# EAGLE design BUZZI-06 (EAGLE 4.15)
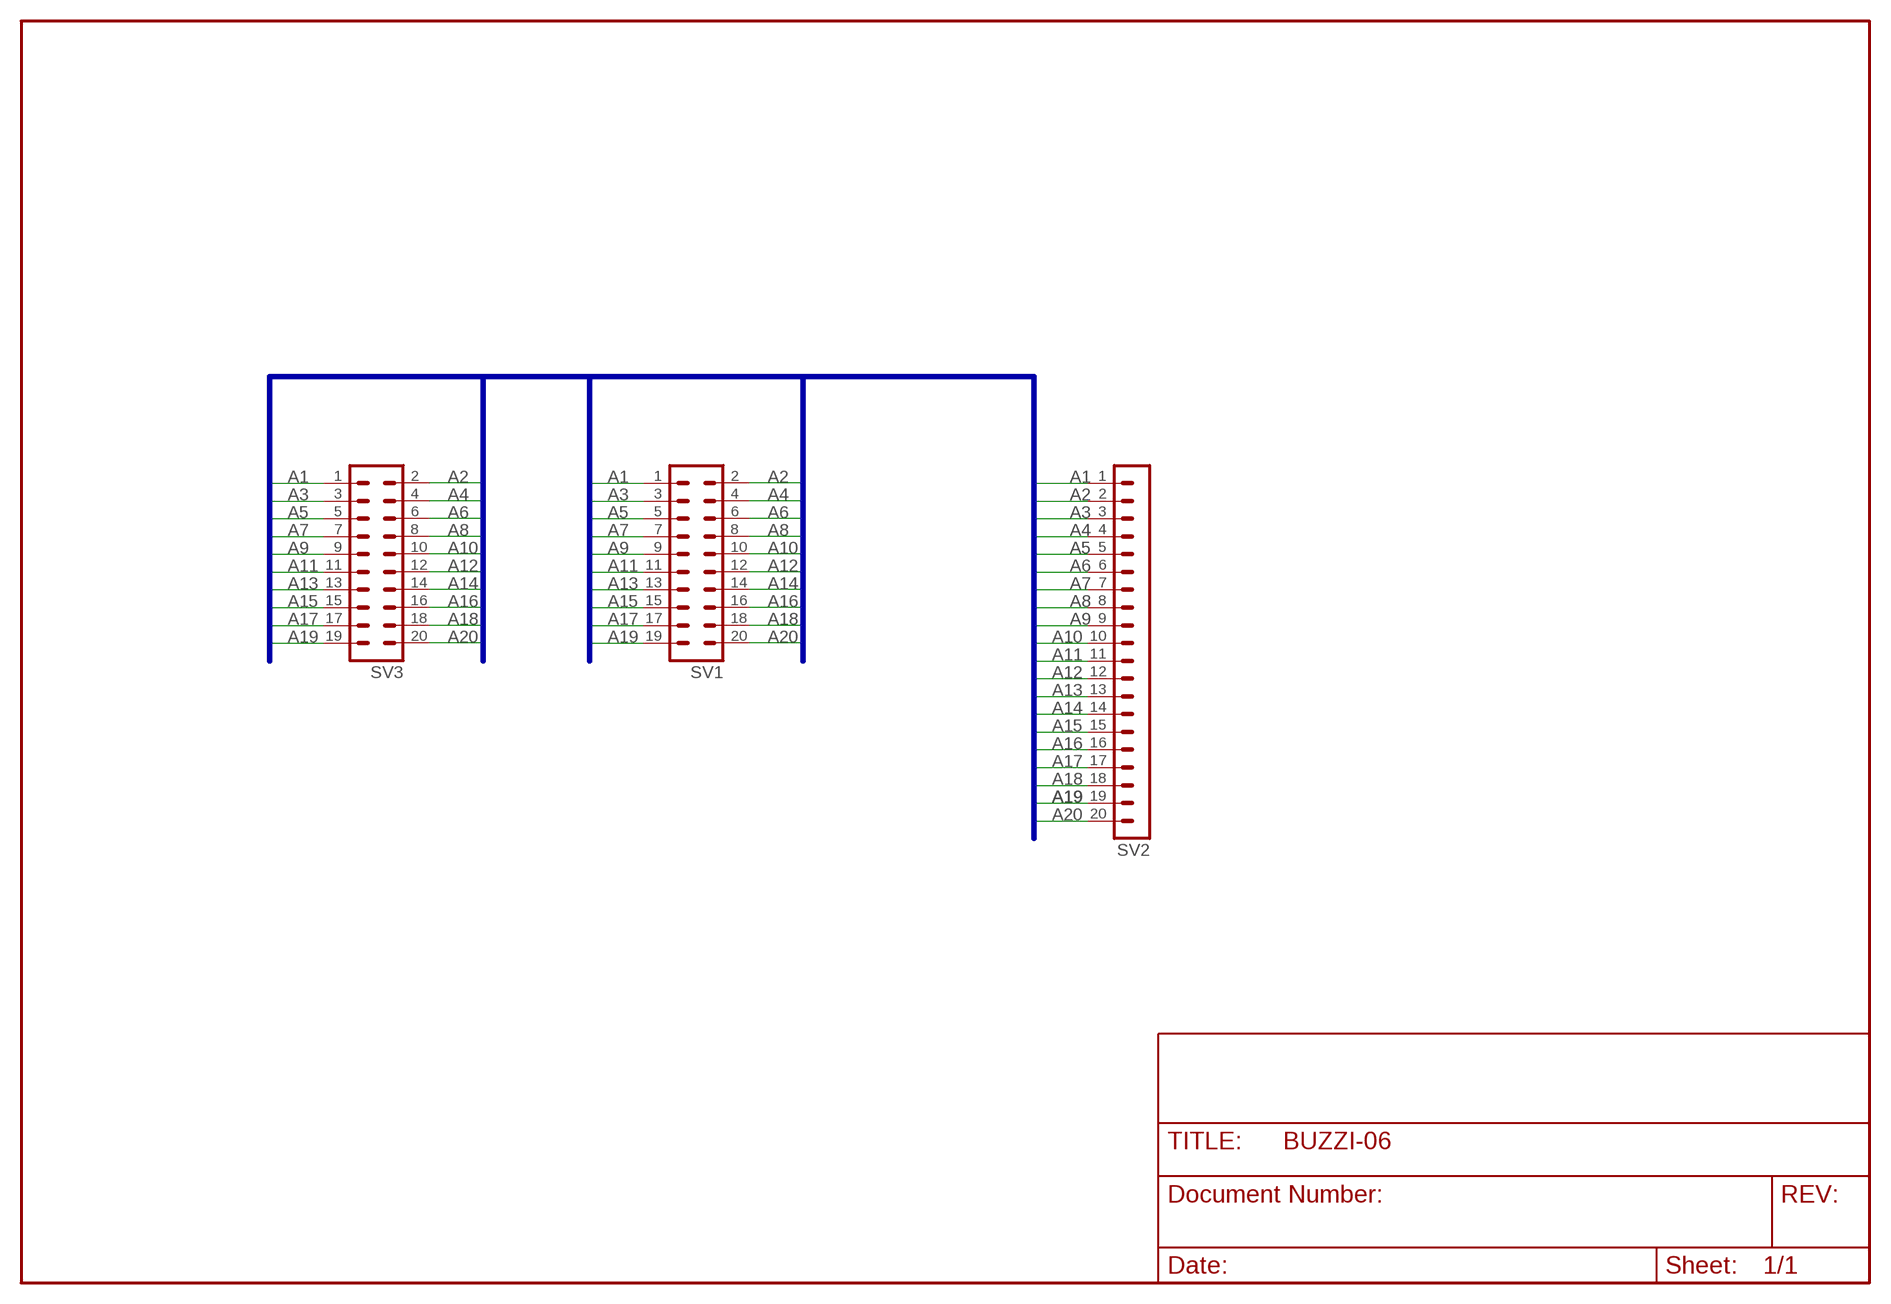
[diagram p0: schematic, sheet 1]

## Parts
SV1  ML20  [ML20]
SV2  MA20-1  [MA20-1]
SV3  ML20  [ML20]

## Nets
A1: SV1.1 SV2.1 SV3.1
A2: SV1.2 SV2.2 SV3.2
A3: SV1.3 SV2.3 SV3.3
A4: SV1.4 SV2.4 SV3.4
A5: SV1.5 SV2.5 SV3.5
A6: SV1.6 SV2.6 SV3.6
A7: SV1.7 SV2.7 SV3.7
A8: SV1.8 SV2.8 SV3.8
A9: SV1.9 SV2.9 SV3.9
A10: SV1.10 SV2.10 SV3.10
A11: SV1.11 SV2.11 SV3.11
A12: SV1.12 SV2.12 SV3.12
A13: SV1.13 SV2.13 SV3.13
A14: SV1.14 SV2.14 SV3.14
A15: SV1.15 SV2.15 SV3.15
A16: SV1.16 SV2.16 SV3.16
A17: SV1.17 SV2.17 SV3.17
A18: SV1.18 SV2.18 SV3.18
A19: SV1.19 SV2.19 SV3.19
A20: SV1.20 SV2.20 SV3.20

## Buses
A[1..20]

## Library data of the parts
SV1 SV3 = con-harting-ml:ML20: HARTING
SV2 = con-lstb:MA20-1: PIN HEADER

## Net classes
0 default: width 0.5 mm

## Board
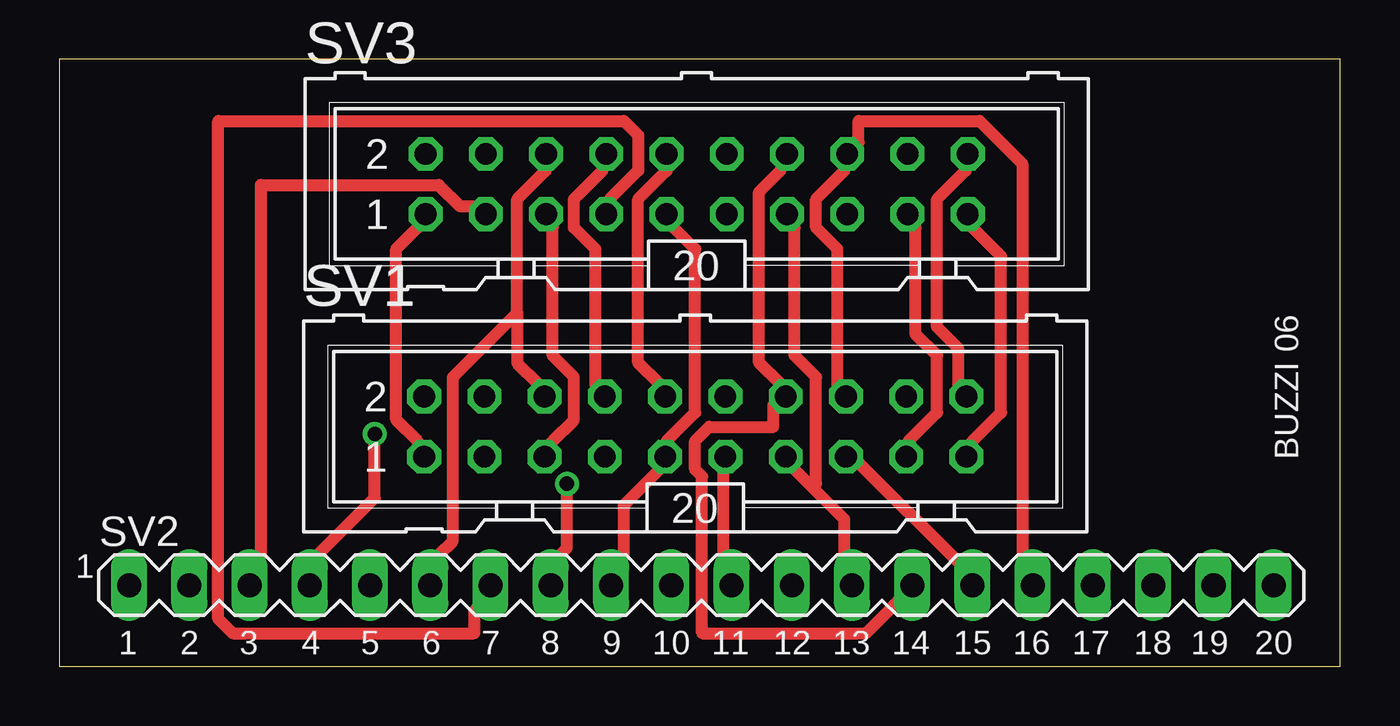
[diagram p1: board, top side]
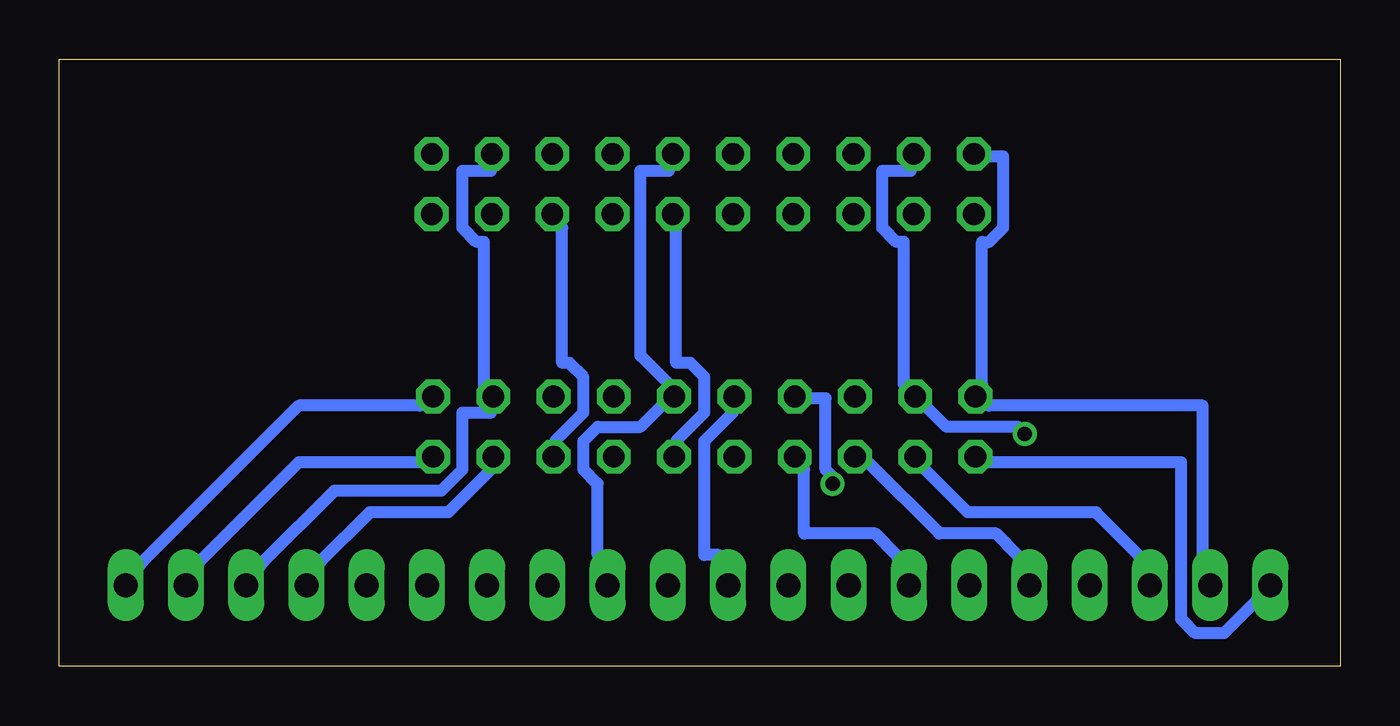
[diagram p2: board, bottom side, seen from below]

Size 54 x 25.6 mm. Coordinates in mm from the lower left corner, seen from the top.
Outline: 0,0 54,0 54,25.6 0,25.6 0,0
Copper layers (1*16): Top 0.035mm / dielectric 1.5mm / Bottom 0.035mm
Design rules "default": minimum track width 10mil, minimum drill 24mil, track to track 8mil, track to pad 8mil, pad to pad 8mil, via to via 8mil, smd to smd 8mil, copper to edge 40mil, drill to drill 8mil, minimum pad ring 10mil, minimum via ring 8mil, stop-mask expansion 4mil, vias tented up to drill 0mil, thermal gap 10mil

### Footprints (pad centres in the part's own frame; a part is rotated, then mirrored left to right if it is on the bottom)
ML20 = drill 0.914 octagon: 1 -11.43,-1.27; 2 -11.43,1.27; 3 -8.89,-1.27; 4 -8.89,1.27; 5 -6.35,-1.27; 6 -6.35,1.27; 7 -3.81,-1.27; 8 -3.81,1.27; 9 -1.27,-1.27; 10 -1.27,1.27; 11 1.27,-1.27; 12 1.27,1.27; 13 3.81,-1.27; 14 3.81,1.27; 15 6.35,-1.27; 16 6.35,1.27; 17 8.89,-1.27; 18 8.89,1.27; 19 11.43,-1.27; 20 11.43,1.27
MA20-1 = drill 1.016 long: 1 -24.13,0; 2 -21.59,0; 3 -19.05,0; 4 -16.51,0; 5 -13.97,0; 6 -11.43,0; 7 -8.89,0; 8 -6.35,0; 9 -3.81,0; 10 -1.27,0; 11 1.27,0; 12 3.81,0; 13 6.35,0; 14 8.89,0; 15 11.43,0; 16 13.97,0; 17 16.51,0; 18 19.05,0; 19 21.59,0; 20 24.13,0

### Placement (x,y rotation side)
SV1  26.81,10.11 0 top
SV2  27.07,3.42 0 top
SV3  26.87,20.34 0 top

### Tracks (layer width: path | path; a pad name or v marks a point on that pad's centre or on a via)
A1
  Top 0.5: SV1.1 15.1,9.5 14.2,10.4 14.2,17.6 15.1,18.5 SV3.1
  Bottom 0.5: SV2.1 3.7,2.6 4.9,1.4 6.1,1.4 6.7,2 6.7,8.6 14.8,8.6 SV1.1
A2
  Bottom 0.5: SV3.2 14.8,21.5 14.2,21.5 14.2,18.5 14.8,17.9 15.1,17.9 15.1,11.9 SV1.2 14.8,11 5.8,11 5.8,4.7 SV2.2
A3
  Top 0.5: SV3.3 17.5,19.4 16.9,19.4 16,20.3 8.5,20.3 8.5,4.7 SV2.3
  Bottom 0.5: SV1.3 17.5,8.3 15.7,6.5 10.3,6.5 8.5,4.7 SV2.3
A4  (via drill 0.61)
  Top 0.5: v13.3,9.8 13.3,7.1 10.9,4.7 SV2.4
  Bottom 0.5: SV3.4 18.1,20.9 19.3,20.9 19.3,18.5 18.7,17.9 18.4,17.9 18.4,11.9 SV1.4 17.5,11 16.6,10.1 13.6,10.1 v13.3,9.8
A5
  Top 0.5: SV3.5 20.8,18.5 20.8,13.1 21.7,12.2 21.7,10.4 20.8,9.5 SV1.5
  Bottom 0.5: SV1.5 19.9,8.6 16.9,5.6 14.5,5.6 13.6,4.7 SV2.5
A6
  Top 0.5: 19.3,14.9 19.3,19.7 20.5,20.9 SV3.6 | 19.3,14.9 19.3,12.8 20.2,11.9 SV1.6 | 19.3,14.9 16.6,12.2 16.6,5.3 16,4.7 SV2.6
A7
  Top 0.5: SV3.7 23.2,19.7 24.4,20.9 24.4,22.4 23.8,23 6.7,23 6.7,2 7.3,1.4 17.5,1.4 17.5,2.3 SV2.7
  Bottom 0.5: SV1.7 22.6,8.3 22.6,5.6 19.6,5.6 18.7,4.7 SV2.7
A8  (via drill 0.61)
  Top 0.5: SV1.8 22.6,11.9 22.6,17.6 21.7,18.5 21.7,19.7 22.9,20.9 SV3.8 | v21.4,7.7 21.4,5 21.1,4.7 SV2.8
  Bottom 0.5: v21.4,7.7 21.4,8 21.7,8.3 21.7,11.3 22.3,11.3 SV1.8
A9
  Top 0.5: SV2.9 23.8,4.7 23.8,6.8 25.3,8.3 SV1.9 25.6,9.5 26.8,10.7 26.8,17.6 25.9,18.5 SV3.9
A10
  Top 0.5: SV3.10 25.6,20.9 24.4,19.7 24.4,12.8 25.3,11.9 SV1.10
  Bottom 0.5: SV1.10 25.6,10.7 26.8,9.5 26.8,4.7 26.2,4.7 SV2.10
A11
  Top 0.5: SV1.11 28,8.3 28,4.7 SV2.11
  Bottom 0.5: SV3.11 28,18.5 28,12.8 27.4,12.8 26.8,12.2 26.8,10.7 28,9.5 SV1.11
A12
  Bottom 0.5: SV3.12 28.3,20.9 29.5,20.9 29.5,13.1 28.3,11.9 SV1.12 28.6,11 29.5,10.1 31.3,10.1 31.9,9.5 31.9,8.3 31.3,7.7 31.3,4.7 SV2.12
A13
  Top 0.5: 31.75,7.55 33.1,6.2 33.1,4.7 SV2.13 | 31.75,7.55 31,8.3 SV1.13 | SV3.13 31,18.5 31,13.1 31.9,12.2 31.9,7.7 31.75,7.55
A14
  Top 0.5: SV3.14 30.4,20.9 29.5,20 29.5,12.8 30.4,11.9 SV1.14 30.1,11 30.1,10.1 27.4,10.1 26.8,9.5 26.8,8.3 27.1,8 27.1,1.4 34,1.4 35.2,2.6 SV2.14
A15
  Top 0.5: SV1.15 33.7,8.6 37.9,4.4 SV2.15
  Bottom 0.5: SV3.15 32.8,18.5 32.8,12.8 32.5,12.8 31.9,12.2 31.9,10.7 33.1,9.5 SV1.15
A16
  Top 0.5: SV1.16 32.8,11.9 32.8,17.6 31.9,18.5 31.9,19.7 33.1,20.9 SV3.16 33.7,22.1 33.7,23 38.8,23 40.6,21.2 40.6,4.7 SV2.16
A17
  Top 0.5: SV1.17 35.8,9.5 37,10.7 37,13.1 36.1,14 36.1,18.5 SV3.17
  Bottom 0.5: SV2.17 43,4.4 40.9,6.5 37.6,6.5 35.8,8.3 SV1.17
A18
  Bottom 0.5: SV3.18 35.8,20.9 37,20.9 37,18.5 36.4,17.9 36.1,17.9 36.1,11.9 SV1.18 35.8,10.7 37,10.7 37,8.3 37.9,7.4 42.4,7.4 45.4,4.4 SV2.18
A19
  Top 0.5: SV1.19 38.5,9.5 39.7,10.7 39.7,17.3 38.5,18.5 SV3.19
  Bottom 0.5: SV2.19 48.1,4.4 43.9,8.6 38.8,8.6 SV1.19
A20
  Top 0.5: SV1.20 37.9,11.9 37.9,13.4 37,14.3 37,19.7 38.2,20.9 SV3.20
  Bottom 0.5: SV2.20 50.5,4.4 43.9,11 38.8,11 SV1.20

### Text on the board
tPlace: BUZZI 06 | 1 | 2 | 3 | 4 | 5 | 6 | 7 | 8 | 9 | 10 | 11 | 12 | 13 | 14 | 15 | 16 | 17 | 18 | 19 | 20